# EAGLE design Ground_Station_Board (EAGLE 9.6.2)
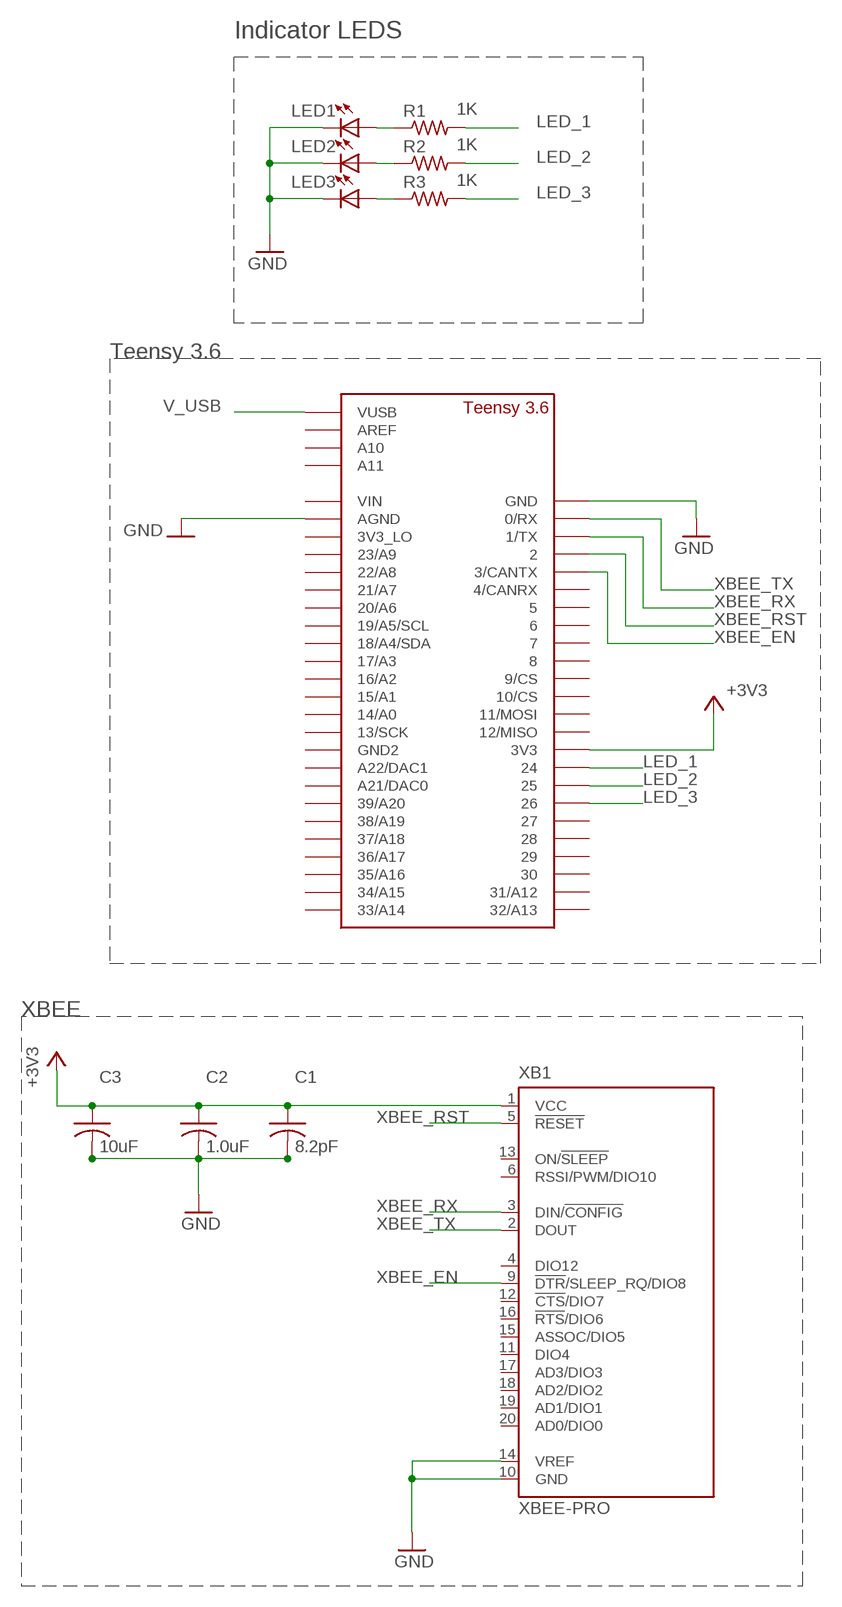
[diagram p0: schematic, sheet 1]

## Parts
C1  8.2pF  C-US025-024X044  [C025-024X044]
C2  1.0uF  C-US025-024X044  [C025-024X044]
C3  10uF  C-US025-024X044  [C025-024X044]
LED1  LED5MM  [LED5MM]
LED2  LED5MM  [LED5MM]
LED3  LED5MM  [LED5MM]
R1  1K  R-US_0207/7  [0207/7]
R2  1K  R-US_0207/7  [0207/7]
R3  1K  R-US_0207/7  [0207/7]
U$2  TEENSY_3.5/3.6_BASIC  [TEENSY_3.5/3.6_BASIC]
XB1  XBEE-PRO  [XBEE-PRO]

## Nets
+3V3: C1.1 C2.1 C3.1 U$2.3V3 XB1.1(VCC)
GND: C1.2 C2.2 C3.2 LED1.K(C) LED2.K(C) LED3.K(C) U$2.AGND U$2.GND XB1.10(GND) XB1.14(VREF)
LED_1: R1.2 U$2.24
LED_2: R2.2 U$2.25
LED_3: R3.2 U$2.26
N$1: LED1.A R1.1
N$2: LED2.A R2.1
N$3: LED3.A R3.1
V_USB: U$2.VUSB
XBEE_EN: U$2.3/CANTX XB1.9(!DTR!/SLEEP_RQ/DIO8)
XBEE_RST: U$2.2 XB1.5(!RESET)
XBEE_RX: U$2.1/TX XB1.3(DIN/!CONFIG)
XBEE_TX: U$2.0/RX XB1.2(DOUT)
Unconnected: U$2.3V3_LO U$2.4/CANRX U$2.5 U$2.6 U$2.7 U$2.8 U$2.9/CS U$2.10/CS U$2.11/MOSI U$2.12/MISO U$2.13/SCK U$2.14/A0 U$2.15/A1 U$2.16/A2 U$2.17/A3 U$2.18/A4/SDA U$2.19/A5/SCL U$2.20/A6 U$2.21/A7 U$2.21/DAC0(A21/DAC0) U$2.22/A8 U$2.23/A9 U$2.27 U$2.28 U$2.29 U$2.30 U$2.31/A12 U$2.32/A13 U$2.33/A14 U$2.34/A15 U$2.35/A16 U$2.36/A17 U$2.37/A18 U$2.38/A19 U$2.39/A20 U$2.A10 U$2.A11 U$2.A22/DAC1 U$2.AREF U$2.GND2 U$2.VIN XB1.4(DIO12) XB1.6(RSSI/PWM/DIO10) XB1.11(DIO4) XB1.12(!CTS!/DIO7) XB1.13(ON/!SLEEP) XB1.15(ASSOC/DIO5) XB1.16(!RTS!/DIO6) XB1.17(AD3/DIO3) XB1.18(AD2/DIO2) XB1.19(AD1/DIO1) XB1.20(AD0/DIO0)

## Notes on the sheet
- Indicator LEDS
- Teensy 3.6
- XBEE

## Library data of the parts
C1-C3 = adafruit:C-US: CAPACITOR, American symbol
LED1-LED3 = adafruit:LED: LED OSRAM: - CHIPLED LG R971, LG N971, LY N971, LG Q971, LY Q971, LO R971, LY R971 LH N974, LH R974 LS Q976, LO Q976, LY Q976 LO Q996 - Hyper CHIPLED LW Q18S LB Q993, LB Q99A, LB R99A - SideLED LS A670, LO A670, LY A670, LG A670, LP A670 LB A673, LV A673, LT A673, LW A673 LH A674 LY A675 LS A676, LA A676, LO A676, LY A676, LW A676 LS A679, LY A679, LG A679 - Hyper Micro SIDELED® LS Y876, LA Y876, LO Y876, LY Y876 LT Y87S - SmartLED LW L88C, LW L88S LB L89C, LB L89S, LG L890 LS L89K, LO L89K, LY L89K LS L896, LA L896, LO L896, LY L896 - TOPLED LS T670, LO T670, LY T670, LG T670, LP T670 LSG T670, LSP T670, LSY T670, LOP T670, LYG T670 LG T671, LOG T671, LSG T671 LB T673, LV T673, LT T673, LW T673 LH T674 LS T676, LA T676, LO T676, LY T676, LB T676, LH T676, LSB T676, LW T676 LB T67C, LV T67C, LT T67C, LS T67K, LO T67K, LY T67K, LW E67C LS E67B, LA E67B, LO E67B, LY E67B, LB E67C, LV E67C, LT E67C LW T67C LS T679, LY T679, LG T679 LS T770, LO T770, LY T770, LG T770, LP T770 LB T773, LV T773, LT T773, LW T773 LH T774 LS E675, LA E675, LY E675, LS T675 LS T776, LA T776, LO T776, LY T776, LB T776 LHGB T686 LT T68C, LB T68C - Hyper Mini TOPLED® LB M676 - Mini TOPLED Santana® LG M470 LS M47K, LO M47K, LY M47K Source: http://www.osram.convergy.de/
R1-R3 = rcl:R-US_: RESISTOR, American symbol; SPICEPREFIX: R
U$2 = Teensy356:TEENSY_3.5/3.6_BASIC
XB1 = xbee:XBEE: XBee (TM) /XBee-PRO(TM) OEM RF Modules Source: MaxStream, Inc. xbee_productmanual.pdf; MPN: XBP24-AWI-001; OC_FARNELL: 1337916; OC_NEWARK: 42M2667

## Board
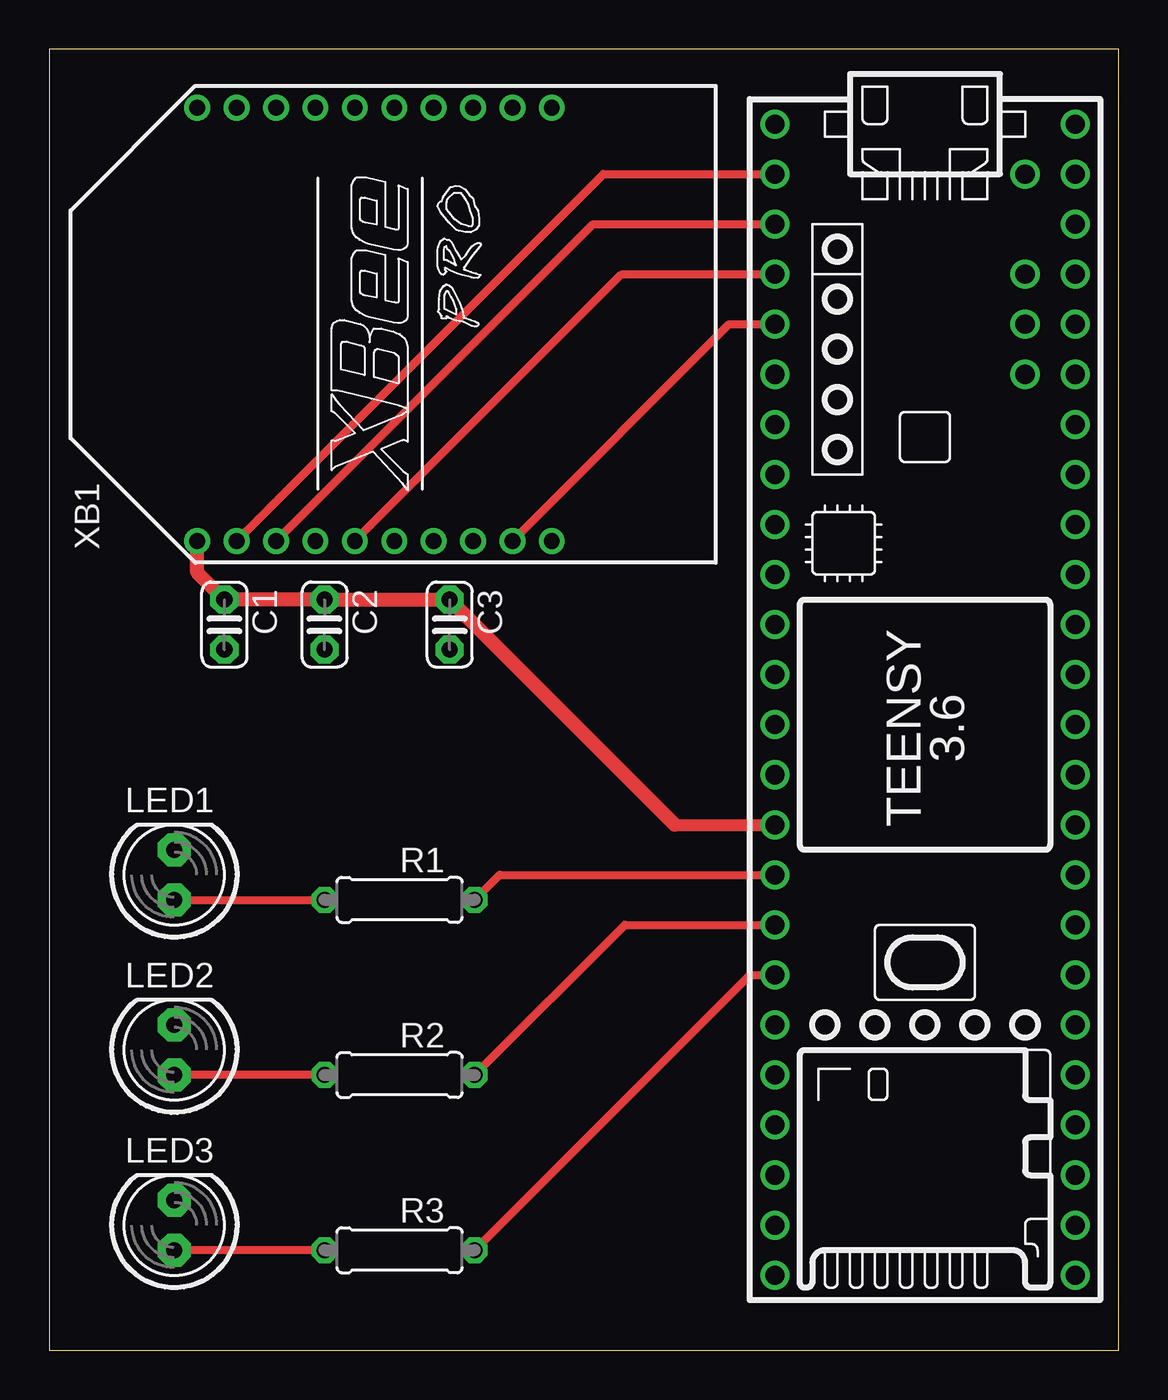
[diagram p1: board, top side]
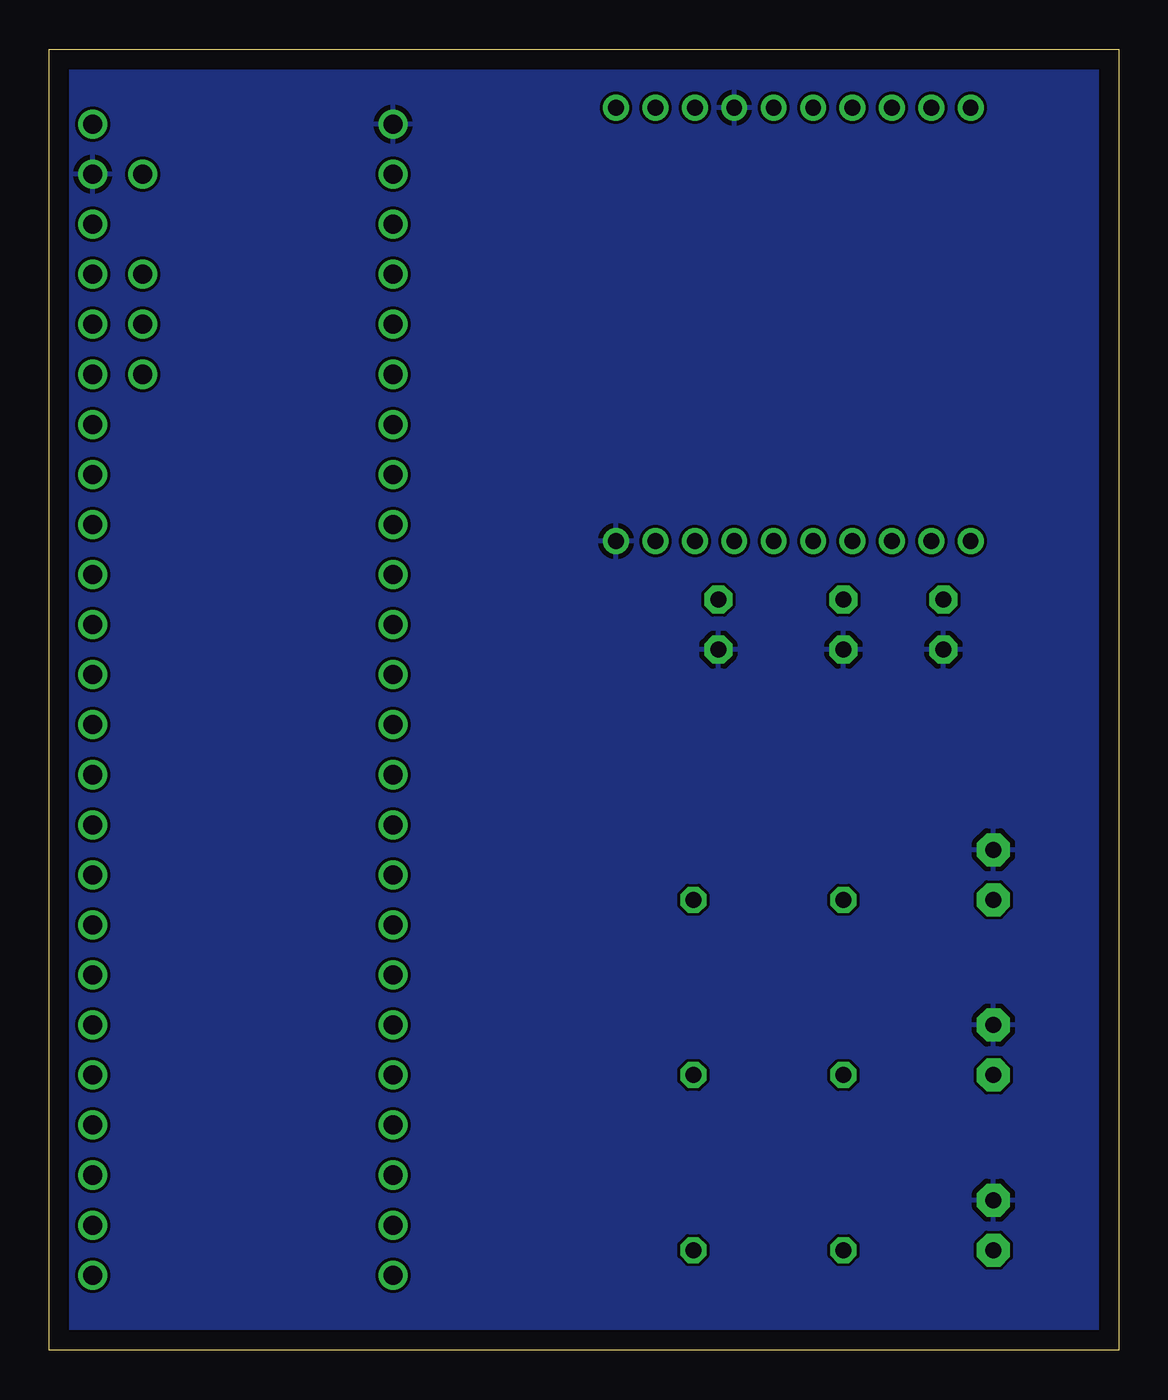
[diagram p2: board, bottom side, seen from below]

Size 54.28 x 66.03 mm. Coordinates in mm from the lower left corner, seen from the top.
Outline: 0,0 54.28,0 54.28,66.03 0,66.03 0,0
Copper layers (1*16): Top 0.035mm / dielectric 1.5mm / Bottom 0.035mm
Design rules "default": minimum track width 6mil, minimum drill 0.35mm, track to track 6mil, track to pad 6mil, pad to pad 6mil, via to via 6mil, smd to smd 6mil, copper to edge 40mil, drill to drill 6mil, minimum pad ring 10mil, minimum via ring 8mil, stop-mask expansion 4mil, vias tented up to drill 0mil, thermal gap 10mil

### Footprints (pad centres in the part's own frame; a part is rotated, then mirrored left to right if it is on the bottom)
C025-024X044 = drill 0.813 pad 1.422 octagon: 1 -1.27,0; 2 1.27,0
LED5MM = drill 0.813 pad 1.676 octagon: A -1.27,0; K 1.27,0
0207/7 = drill 0.813 octagon: 1 -3.81,0; 2 3.81,0
TEENSY_3.5/3.6_BASIC = drill 0.965: 0/RX -25.4,-7.62; 1/TX -22.86,-7.62; 2 -20.32,-7.62; 3/CANTX -17.78,-7.62; 3V3 7.62,-7.62; 3V3_LO -22.86,7.62; 4/CANRX -15.24,-7.62; 5 -12.7,-7.62; 6 -10.16,-7.62; 7 -7.62,-7.62; 8 -5.08,-7.62; 9/CS -2.54,-7.62; 10/CS 0,-7.62; 11/MOSI 2.54,-7.62; 12/MISO 5.08,-7.62; 13/SCK 5.08,7.62; 14/A0 2.54,7.62; 15/A1 0,7.62; 16/A2 -2.54,7.62; 17/A3 -5.08,7.62; 18/A4/SDA -7.62,7.62; 19/A5/SCL -10.16,7.62; 20/A6 -12.7,7.62; 21/A7 -15.24,7.62; 21/DAC0 12.7,7.62; 22/A8 -17.78,7.62; 23/A9 -20.32,7.62; 24 10.16,-7.62; 25 12.7,-7.62; 26 15.24,-7.62; 27 17.78,-7.62; 28 20.32,-7.62; 29 22.86,-7.62; 30 25.4,-7.62; 31/A12 27.94,-7.62; 32/A13 30.48,-7.62; 33/A14 30.48,7.62; 34/A15 27.94,7.62; 35/A16 25.4,7.62; 36/A17 22.86,7.62; 37/A18 20.32,7.62; 38/A19 17.78,7.62; 39/A20 15.24,7.62; A10 -17.78,5.08; A11 -15.24,5.08; A22/DAC1 10.16,7.62; AGND -25.4,7.62; AREF -20.32,5.08; GND -27.94,-7.62; GND2 7.62,7.62; VIN -27.94,7.62; VUSB -25.4,5.08
XBEE-PRO = drill 0.8 pad 1.27: 1 -11,9; 2 -11,7; 3 -11,5; 4 -11,3; 5 -11,1; 6 -11,-1; 7 -11,-3; 8 -11,-5; 9 -11,-7; 10 -11,-9; 11 11,-9; 12 11,-7; 13 11,-5; 14 11,-3; 15 11,-1; 16 11,1; 17 11,3; 18 11,5; 19 11,7; 20 11,9

### Placement (x,y rotation side)
C1  8.89,36.83 270 top
C2  13.97,36.83 270 top
C3  20.32,36.83 270 top
LED1  6.35,24.13 90 top
LED2  6.35,15.24 90 top
LED3  6.35,6.35 90 top
R1  17.78,22.86 0 top
R2  17.78,13.97 0 top
R3  17.78,5.08 0 top
U$2  44.45,34.29 270 top
XB1  16.51,52.07 90 top

### Tracks (layer width: path | path; a pad name or v marks a point on that pad's centre or on a via)
+3V3
  Top 0.61: C1.1 8.47,38.52 | 31.75,26.67 U$2.3V3
  Top 0.711: 31.75,26.67 C3.1 C2.1 C1.1 7.51,39.48 XB1.1
GND
  pour Bottom: 0,66.04 54.61,66.04 54.61,0 0,0
LED_1
  Top 0.406: R1.2 22.86,24.13 U$2.24
LED_2
  Top 0.406: R2.2 29.21,21.59 U$2.25
LED_3
  Top 0.406: R3.2 35.56,19.05 U$2.26
N$1
  Top 0.406: LED1.A R1.1
N$2
  Top 0.406: R2.1 LED2.A
N$3
  Top 0.406: R3.1 LED3.A
XBEE_EN
  Top 0.406: XB1.9 34.51,52.07 U$2.3/CANTX
XBEE_RST
  Top 0.406: U$2.2 29.05,54.61 XB1.5
XBEE_RX
  Top 0.406: XB1.3 27.59,57.15 U$2.1/TX
XBEE_TX
  Top 0.406: XB1.2 28.13,59.69 U$2.0/RX